# EAGLE design main (EAGLE 8.3.0)
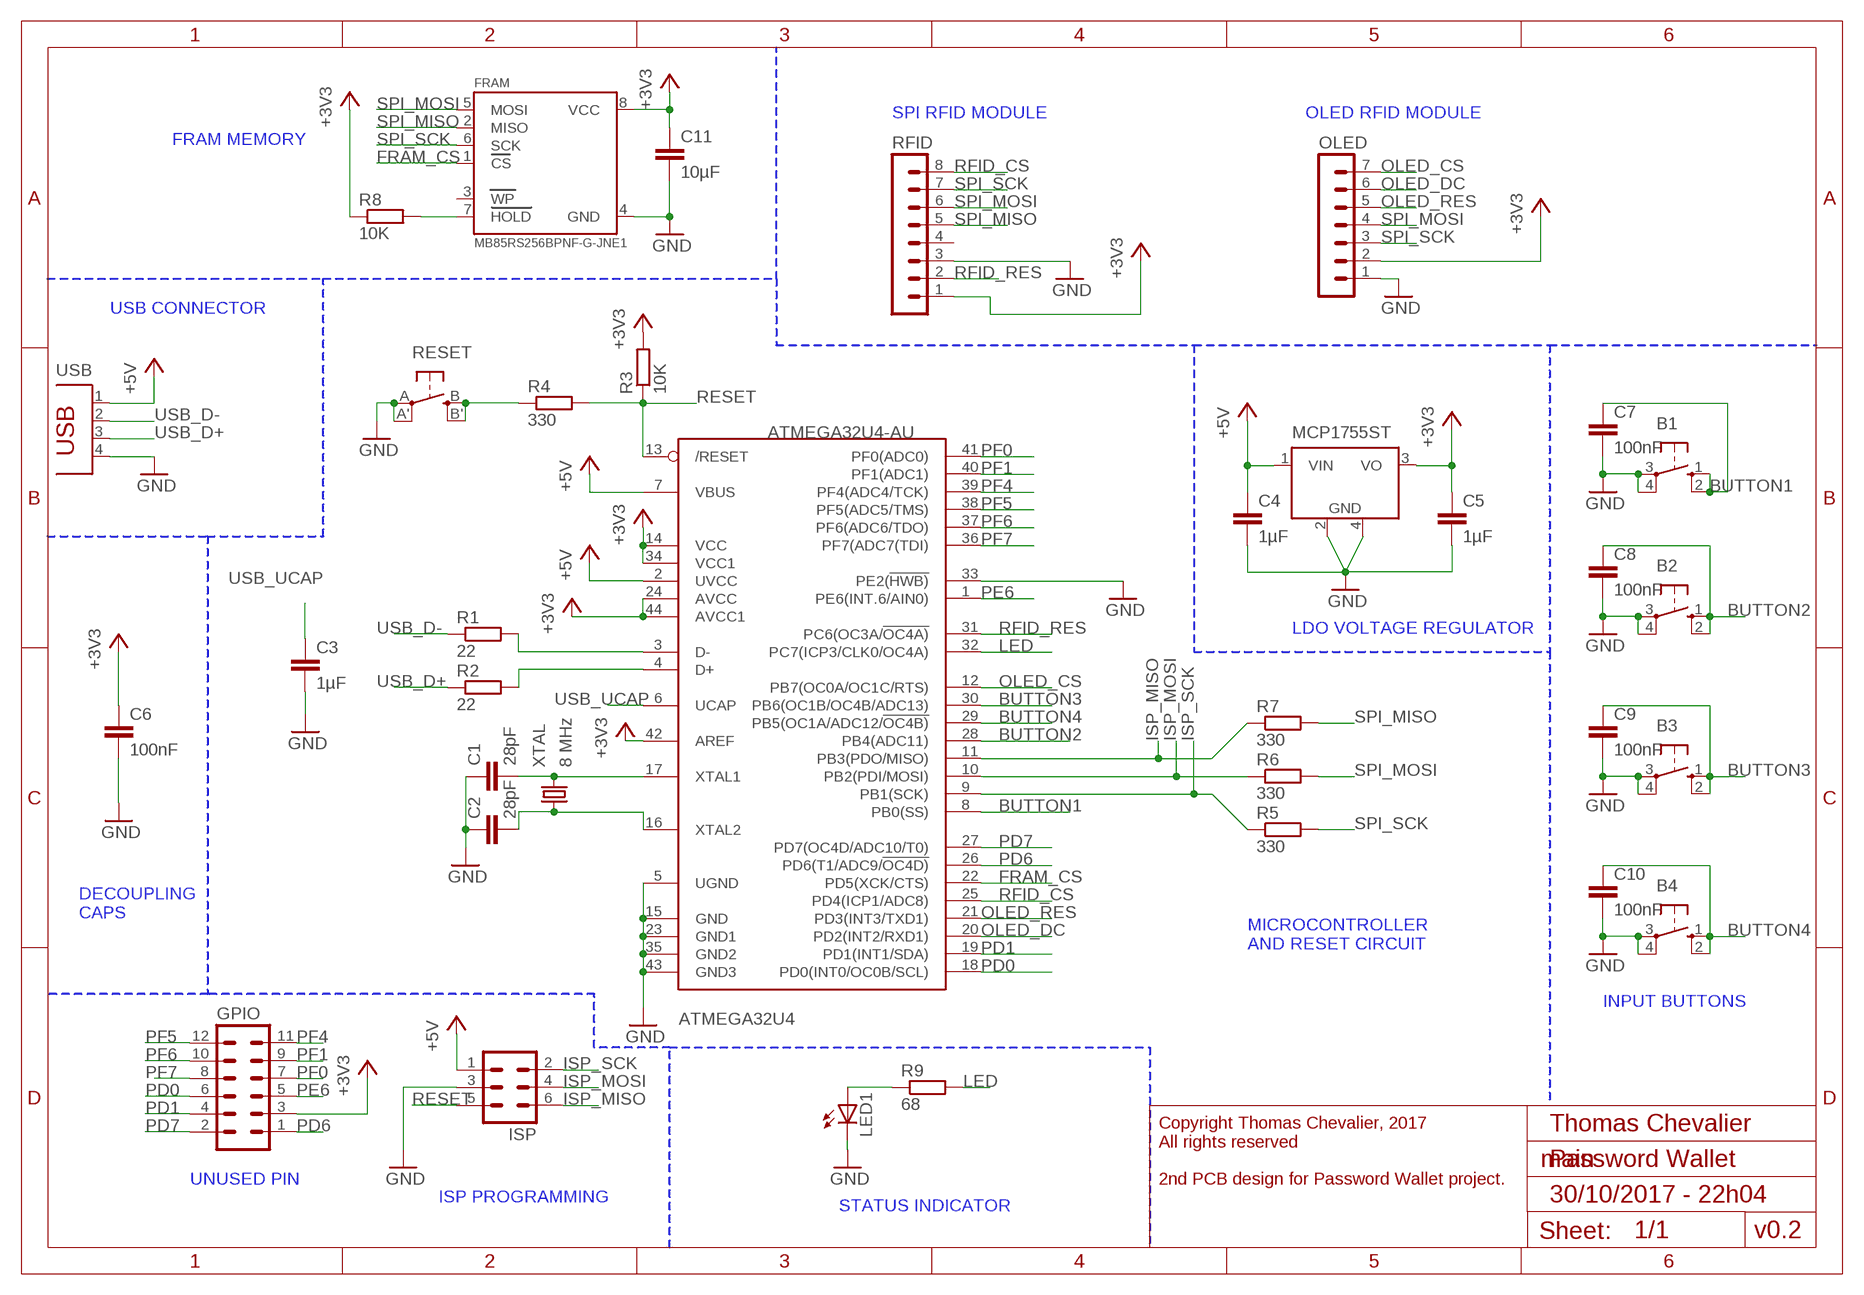
[diagram p0: schematic, sheet 1]

## Parts
ATMEGA32U4  ATMEGA32U4-AU  [TQFP44]
B1  10-XX  [B3F-10XX]
B2  10-XX  [B3F-10XX]
B3  10-XX  [B3F-10XX]
B4  10-XX  [B3F-10XX]
C1  28pF  C-EUC0805  [C0805]
C2  28pF  C-EUC0805  [C0805]
C3  1µF  C-EUC0805  [C0805]
C4  1µF  C-EUC0805  [C0805]
C5  1µF  C-EUC0805  [C0805]
C6  100nF  C-EUC0805  [C0805]
C7  100nF  C-EUC0805  [C0805]
C8  100nF  C-EUC0805  [C0805]
C9  100nF  C-EUC0805  [C0805]
C10  100nF  C-EUC0805  [C0805]
C11  10µF  C-EUC0805  [C0805]
FRAM  MB85RS256BPNF-G-JNE1  FRAM_SOIC8_SPI  [SOIC8_150MIL]
GPIO  MA06-2  [MA06-2]
ISP  MA03-2  [MA03-2]
LED1  LEDCHIP-LED0805  [CHIP-LED0805]
MCP1755ST  LM2936MP-3.0  [SOT223]
OLED  MA07-1  [MA07-1]
R1  22  R-EU_R0805  [R0805]
R2  22  R-EU_R0805  [R0805]
R3  10K  R-EU_R0805  [R0805]
R4  330  R-EU_R0805  [R0805]
R5  330  R-EU_R0805  [R0805]
R6  330  R-EU_R0805  [R0805]
R7  330  R-EU_R0805  [R0805]
R8  10K  R-EU_R0805  [R0805]
R9  68  R-EU_R0805  [R0805]
RESET  SPST_TACT-EVQQ2  [EVQ-Q2]
RFID  MA08-1  [MA08-1]
USB  PN87520  [PN87520]
XTAL  8 MHz  KX-9B  [5.0X3.2_2]

## Nets
+3V3: ATMEGA32U4.14(VCC) ATMEGA32U4.24(AVCC) ATMEGA32U4.34(VCC1) ATMEGA32U4.42(AREF) ATMEGA32U4.44(AVCC1) C5.1 C6.1 C11.1 FRAM.8(VCC) GPIO.3 MCP1755ST.3(VO) OLED.2 R3.2 R8.1 RFID.1
+5V: ATMEGA32U4.2(UVCC) ATMEGA32U4.7(VBUS) C4.1 ISP.1 MCP1755ST.1(VIN) USB.1
BUTTON1: ATMEGA32U4.8(PB0(SS)) B1.1(S) B1.2(S1) C7.1
BUTTON2: ATMEGA32U4.28(PB4(ADC11)) B2.1(S) B2.2(S1) C8.1
BUTTON3: ATMEGA32U4.30(PB6(OC1B/OC4B/ADC13)) B3.1(S) B3.2(S1) C9.1
BUTTON4: ATMEGA32U4.29(PB5(OC1A/ADC12/!OC4B)) B4.1(S) B4.2(S1) C10.1
FRAM_CS: ATMEGA32U4.22(PD5(XCK/CTS)) FRAM.1(CS)
GND: ATMEGA32U4.5(UGND) ATMEGA32U4.15(GND) ATMEGA32U4.23(GND1) ATMEGA32U4.33(PE2(!HWB)) ATMEGA32U4.35(GND2) ATMEGA32U4.43(GND3) B1.3(P) B1.4(P1) B2.3(P) B2.4(P1) B3.3(P) B3.4(P1) B4.3(P) B4.4(P1) C1.1 C2.1 C3.2 C4.2 C5.2 C6.2 C7.2 C8.2 C9.2 C10.2 C11.2 FRAM.4(GND) ISP.3 LED1.C MCP1755ST.2(GND) MCP1755ST.4(GND) OLED.1 RESET.A'(P1) RESET.A(P) RFID.3 USB.4
ISP_MISO: ATMEGA32U4.11(PB3(PDO/MISO)) ISP.6 R7.1
ISP_MOSI: ATMEGA32U4.10(PB2(PDI/MOSI)) ISP.4 R6.1
ISP_SCK: ATMEGA32U4.9(PB1(SCK)) ISP.2 R5.1
LED: ATMEGA32U4.32(PC7(ICP3/CLK0/OC4A)) R9.2
N$1: ATMEGA32U4.3(D-) R1.2
N$2: ATMEGA32U4.17(XTAL1) C1.2 XTAL.2
N$3: ATMEGA32U4.4(D+) R2.2
N$4: ATMEGA32U4.16(XTAL2) C2.2 XTAL.1
N$6: LED1.A R9.1
N$9: R4.1 RESET.B'(S1) RESET.B(S)
N$13: FRAM.7(HOLD) R8.2
OLED_CS: ATMEGA32U4.12(PB7(OC0A/OC1C/RTS)) OLED.7
OLED_DC: ATMEGA32U4.20(PD2(INT2/RXD1)) OLED.6
OLED_RES: ATMEGA32U4.21(PD3(INT3/TXD1)) OLED.5
PD0: ATMEGA32U4.18(PD0(INT0/OC0B/SCL)) GPIO.6
PD1: ATMEGA32U4.19(PD1(INT1/SDA)) GPIO.4
PD6: ATMEGA32U4.26(PD6(T1/ADC9/!OC4D)) GPIO.1
PD7: ATMEGA32U4.27(PD7(OC4D/ADC10/T0)) GPIO.2
PE6: ATMEGA32U4.1(PE6(INT.6/AIN0)) GPIO.5
PF0: ATMEGA32U4.41(PF0(ADC0)) GPIO.7
PF1: ATMEGA32U4.40(PF1(ADC1)) GPIO.9
PF4: ATMEGA32U4.39(PF4(ADC4/TCK)) GPIO.11
PF5: ATMEGA32U4.38(PF5(ADC5/TMS)) GPIO.12
PF6: ATMEGA32U4.37(PF6(ADC6/TDO)) GPIO.10
PF7: ATMEGA32U4.36(PF7(ADC7(TDI)) GPIO.8
RESET: ATMEGA32U4.13(/RESET) ISP.5 R3.1 R4.2
RFID_CS: ATMEGA32U4.25(PD4(ICP1/ADC8)) RFID.8
RFID_RES: ATMEGA32U4.31(PC6(OC3A/!OC4A)) RFID.2
SPI_MISO: FRAM.2(MISO) R7.2 RFID.5
SPI_MOSI: FRAM.5(MOSI) OLED.4 R6.2 RFID.6
SPI_SCK: FRAM.6(SCK) OLED.3 R5.2 RFID.7
USB_D+: R2.1 USB.3
USB_D-: R1.1 USB.2
USB_UCAP: ATMEGA32U4.6(UCAP) C3.1
Unconnected: FRAM.3(WP) RFID.4

## Notes on the sheet
- SPI RFID MODULE | OLED RFID MODULE
- FRAM MEMORY
- USB CONNECTOR
- LDO VOLTAGE REGULATOR
- DECOUPLING
  CAPS
- MICROCONTROLLER
  AND RESET CIRCUIT
- INPUT BUTTONS
- Thomas Chevalier
- Password Wallet
- UNUSED PIN
- Copyright Thomas Chevalier, 2017
  All rights reserved
  
  2nd PCB design for Password Wallet project.
- ISP PROGRAMMING | 30/10/2017 - 22h04
- STATUS INDICATOR
- v0.2

## Library data of the parts
ATMEGA32U4 = adafruit:ATMEGA32U4: http://www.ladyada.net/library/eagle
B1-B4 = switch-omron:10-XX: OMRON SWITCH; MPN: B3F-1000; OC_FARNELL: 176432; OC_NEWARK: 36M3542
C1-C11 = resistor:C-EU: CAPACITOR, European symbol
FRAM = microbuilder:FRAM_SOIC8_SPI: SPI FRAM - SOIC8 Package 64KBit (8Kx8) - MB85RS64VPNF-G-JNERE1 - SOIC-8 150 Mil, 3-5.5V, -40°C-85°C, 20MHz
GPIO = con-lstb:MA06-2: PIN HEADER; OC_FARNELL: unknown; OC_NEWARK: unknown
ISP = con-lstb:MA03-2: PIN HEADER; OC_FARNELL: unknown; OC_NEWARK: unknown
LED1 = adafruit:LED: LED OSRAM: - CHIPLED LG R971, LG N971, LY N971, LG Q971, LY Q971, LO R971, LY R971 LH N974, LH R974 LS Q976, LO Q976, LY Q976 LO Q996 - Hyper CHIPLED LW Q18S LB Q993, LB Q99A, LB R99A - SideLED LS A670, LO A670, LY A670, LG A670, LP A670 LB A673, LV A673, LT A673, LW A673 LH A674 LY A675 LS A676, LA A676, LO A676, LY A676, LW A676 LS A679, LY A679, LG A679 - Hyper Micro SIDELED® LS Y876, LA Y876, LO Y876, LY Y876 LT Y87S - SmartLED LW L88C, LW L88S LB L89C, LB L89S, LG L890 LS L89K, LO L89K, LY L89K LS L896, LA L896, LO L896, LY L896 - TOPLED LS T670, LO T670, LY T670, LG T670, LP T670 LSG T670, LSP T670, LSY T670, LOP T670, LYG T670 LG T671, LOG T671, LSG T671 LB T673, LV T673, LT T673, LW T673 LH T674 LS T676, LA T676, LO T676, LY T676, LB T676, LH T676, LSB T676, LW T676 LB T67C, LV T67C, LT T67C, LS T67K, LO T67K, LY T67K, LW E67C LS E67B, LA E67B, LO E67B, LY E67B, LB E67C, LV E67C, LT E67C LW T67C LS T679, LY T679, LG T679 LS T770, LO T770, LY T770, LG T770, LP T770 LB T773, LV T773, LT T773, LW T773 LH T774 LS E675, LA E675, LY E675, LS T675 LS T776, LA T776, LO T776, LY T776, LB T776 LHGB T686 LT T68C, LB T68C - Hyper Mini TOPLED® LB M676 - Mini TOPLED Santana® LG M470 LS M47K, LO M47K, LY M47K Source: http://www.osram.convergy.de/
MCP1755ST = national-semiconductor:LM2936MP?*: Ultra-Low Quiescent Current LDO Voltage Regulator Source: Data sheet <http://www.national.com/ds/LM/LM2936.pdf>; MF: NATIONAL SEMICONDUCTOR; MPN: LM2936MP-3.0/NOPB; OC_FARNELL: 1496125; OC_NEWARK: 41K4522
OLED = con-lstb:MA07-1: PIN HEADER; OC_FARNELL: unknown; OC_NEWARK: unknown
R1-R9 = resistor:R-EU_: RESISTOR, European symbol
RESET = adafruit:SPST_TACT: SMT 6mm switch, EVQQ2 series http://www.ladyada.net/library/eagle
RFID = con-lstb:MA08-1: PIN HEADER; OC_FARNELL: unknown; OC_NEWARK: unknown
USB = con-berg:PN87520: BERG USB connector; OC_FARNELL: unknown; OC_NEWARK: unknown
XTAL = crystal-geyer_V1_0:KX: Quartz Crystals (MHz) SMD: KX - Serie Model Size l/w/h [mm] Frequency Range Frequency Stability Temp. Range [°C] Load Capacitance AECQ 200 availabel Datasheet KX-4 KX-5 KX-6 KX-7 KX-9A KX-9B KX-12A KX-12B KX-13 KX-20 KX-K KX-KS 1.6/1.2/0.3 2.0/1.6/0.45 2.5/2.0/0.55 3.2/2.5/0.8 5.0/3.2/1.0 5.0/3.2/1.1 6.0/3.5/1.1 6.0/3.5/1.0 7.0/5.0 /1.3 11.6/5.5/1.6 12.3/4.5/4.2 12.3/4.5/3.2 24.0 ~ 80.0 MHz 16.0 ~ 80.0 MHz 12.0 ~ 80.0 MHz 8.0 ~ 60.0 MHz 7,68 ~ 300,0 MHz 8,0 ~ 50,0 MHz 8,0 ~ 150,0 MHz 8,0 ~ 50,0 MHz 6,0 ~ 160,0 MHz 3,579 ~ 25,0 MHz 3,579 ~ 70,0 MHz 3,579 ~ 70,0 MHz ±10 … ±50ppm ±10 … ±50ppm ±10 … ±50ppm ±10 … ±50ppm ±10 … ±50ppm ±10 … ±50ppm ±10 … ±50ppm ±10 … ±50ppm ±10 … ±50ppm ±50ppm ±10 … ±50ppm ±10 … ±50ppm (*) -40°C …+85°C (*) -40°C …+125°C (*) -40°C …+125°C (*) -40°C …+125°C (*) -40°C …+105°C (*) -40°C …+105°C (*) -40°C …+125°C (*) -40°C …+105°C (*) -40°C …+105°C (*) -40°C …+105°C (*) -40°C …+85°C (*) -40°C …+85°C 8, 8…16 8, 8…16 10, 8…16 12, 7…20 16, 10…20 16, 10…20 16, 10…20 16, 12…20 16, 12…20 16, 12…20 16, 12…30 16, 12…30 - yes yes yes - - - - - - - - KX-4.pdf <http://www.geyer-electronic.de/uploads/tx_userartikelfrequenz/GEYER-KX-4.pdf> KX-5.pdf <http://www.geyer-electronic.de/uploads/tx_userartikelfrequenz/GEYER-KX-5.pdf> KX-6.pdf <http://www.geyer-electronic.de/uploads/tx_userartikelfrequenz/GEYER-KX-6.pdf> KX-7.pdf <http://www.geyer-electronic.de/uploads/tx_userartikelfrequenz/GEYER-KX-7.pdf> KX-9A.pdf <http://www.geyer-electronic.de/uploads/tx_userartikelfrequenz/GEYER-KX-9A.pdf> KX-9B.pdf <http://www.geyer-electronic.de/uploads/tx_userartikelfrequenz/GEYER-KX-9B.pdf> KX-12A.pdf <http://www.geyer-electronic.de/uploads/tx_userartikelfrequenz/GEYER-KX-12A.pdf> KX-12B.pdf <http://www.geyer-electronic.de/uploads/tx_userartikelfrequenz/GEYER-KX-12B.pdf> KX-13.pdf <http://www.geyer-electronic.de/uploads/tx_userartikelfrequenz/GEYER-KX-13.pdf> KX-20.pdf <http://www.geyer-electronic.de/uploads/tx_userartikelfrequenz/GEYER-KX-20.pdf> KX-K.pdf <http://www.geyer-electronic.de/uploads/tx_userartikelfrequenz/GEYER-KX-K.pdf> KX-KS.pdf <http://www.geyer-electronic.de/uploads/tx_userartikelfrequenz/GEYER-KX-KS.pdf> <http://www.geyer-electronic.de/fileadmin/template/img/logo-geyer-electronic.png> Details see: http://www.geyer-electronic.de/Frequenz-Produkte.9.0.html Created 2016-06-07, Hans Locher 2016 (C) Geyer Quartz Technology KX4,KX5,KX6,KX7,KX9A,KX9B,KX12A,KX12B,KX13,KX20,KXK,KXKS;1612;2016;2520;3225;5032;6035;7050;11655;12345;1,6x1,2;2,0x1,6;2,5x2,0;3,2x2,5;5,0x3,2;6,0x3,5;7,0x5,0;11,6x5,5;12,3x4,5;12,3x4,5;1.6x1.2;2.0x1.6;2.5x2.0;3.2x2.5;5.0x3.2;6.0x3.5;7.0x5.0;11.6x5.5;12.3x4.5;12.3x4.5;

## Board
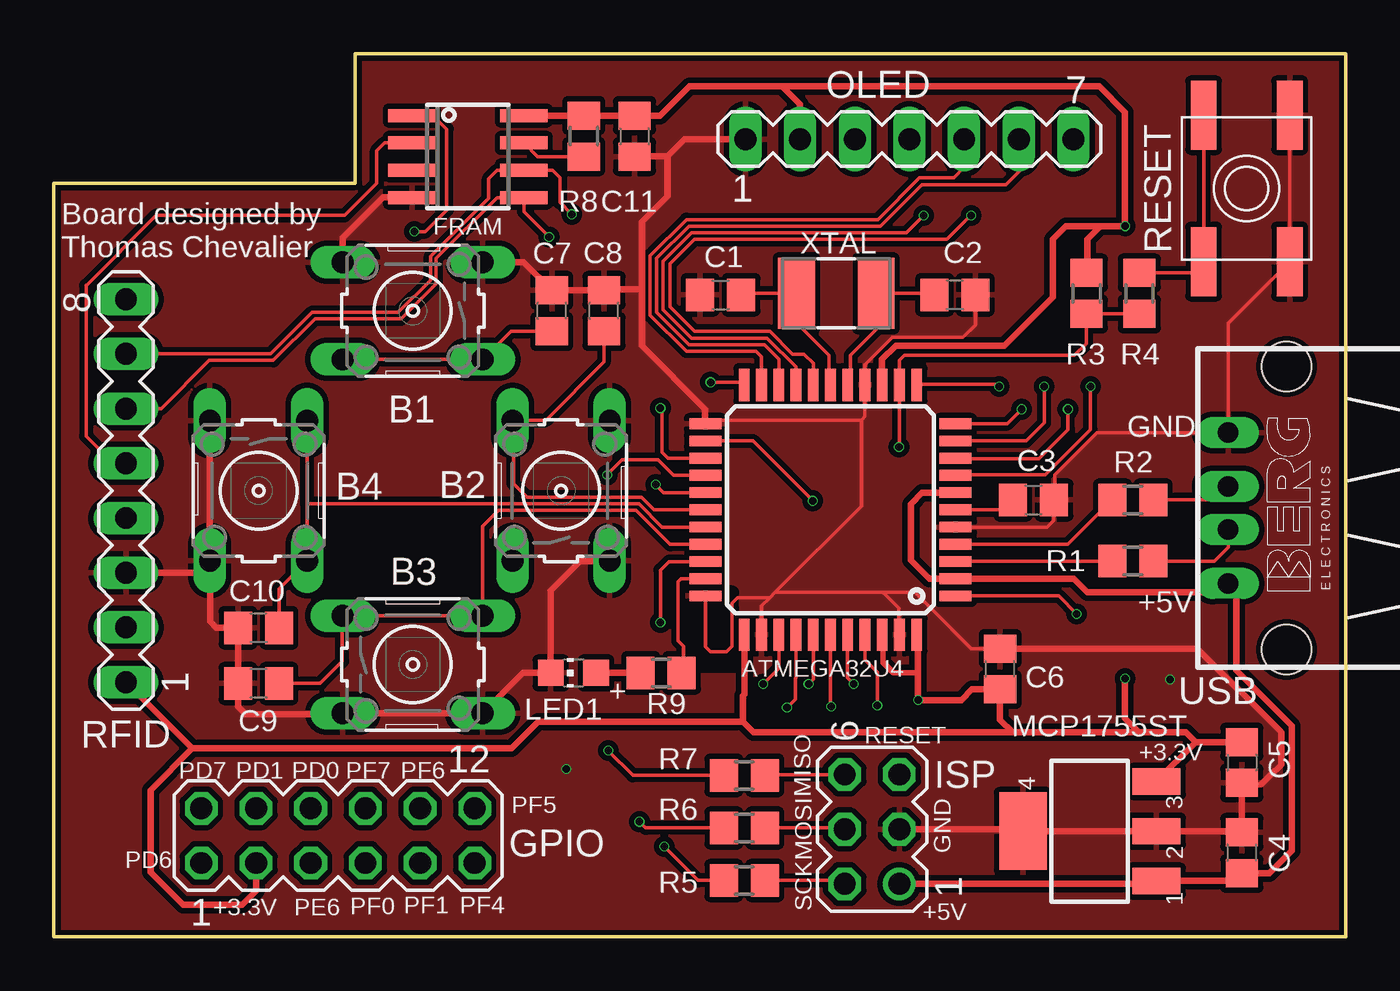
[diagram p1: board, top side]
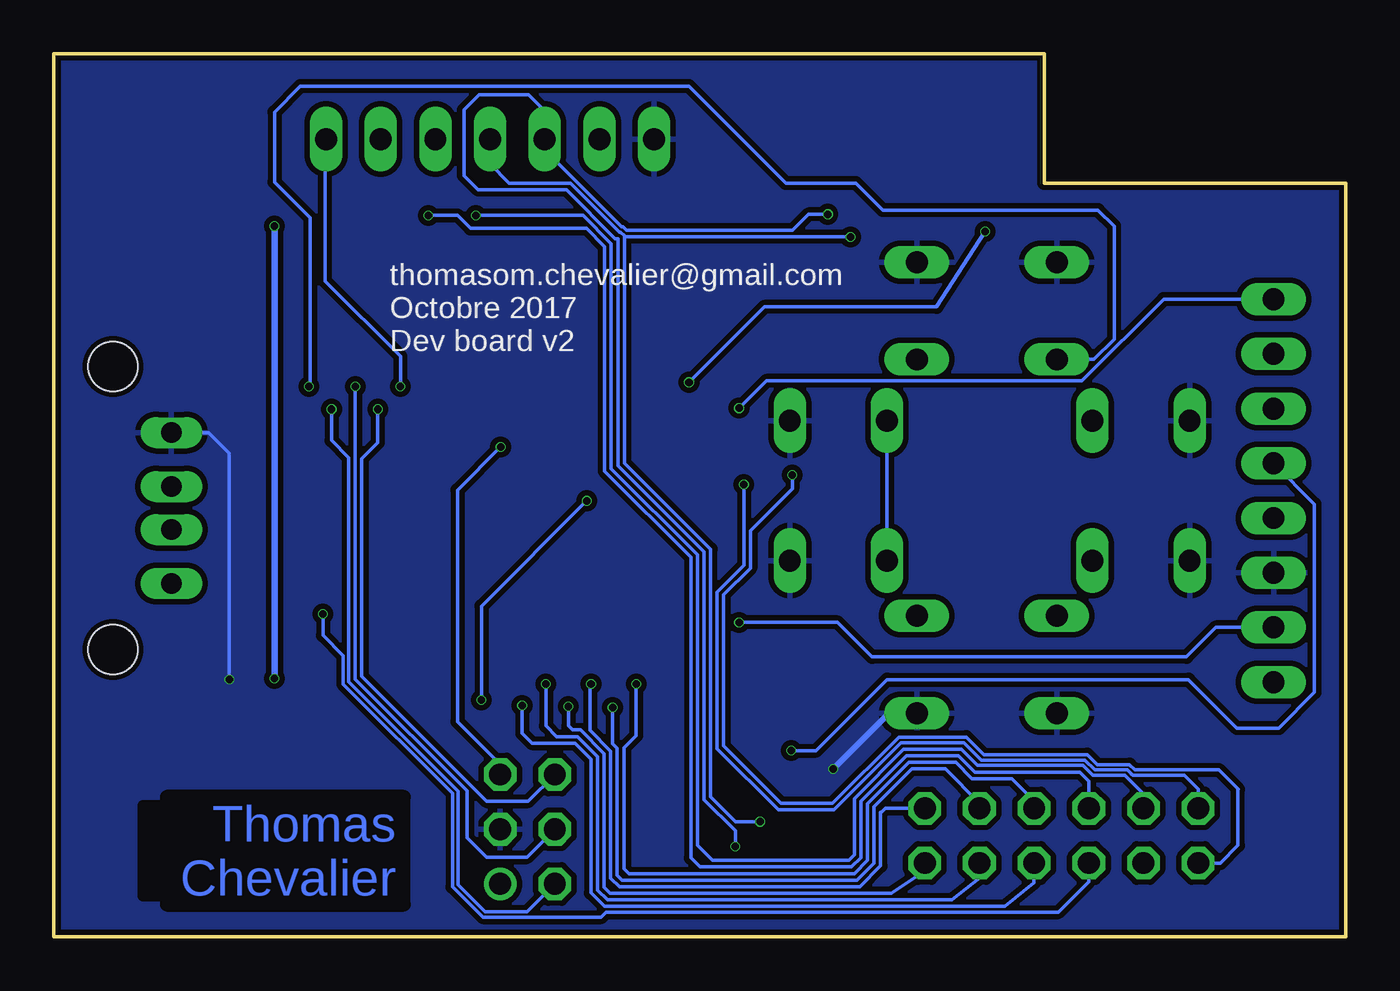
[diagram p2: board, bottom side, seen from below]

Size 60 x 41 mm. Coordinates in mm from the lower left corner, seen from the top.
Outline: 0,0 60,0 60,41 14,41 14,35 0,35 0,0
Copper layers (1*16): Top 0.035mm / dielectric 1.5mm / Bottom 0.035mm
Design rules "aisler_go_2layer": minimum track width 0.1mm, minimum drill 0.2mm, track to track 0.1mm, track to pad 0.1mm, pad to pad 0.1mm, via to via 0.1mm, smd to smd 0.1mm, copper to edge 0.2mm, drill to drill 0.21mm, minimum pad ring 0.25mm, minimum via ring 0.05mm, stop-mask expansion 0.01mm, vias tented up to drill 0mil, thermal gap 10mil
tRestrict: area 29.8,13.2 to 31.5,15.2; area 31,15.2 to 31.5,16; area 29.9,12.6 to 31.8,13.2
bRestrict: area 43.8,1.5 to 54.8,6.5

### Footprints (pad centres in the part's own frame; a part is rotated, then mirrored left to right if it is on the bottom)
TQFP44 = smd 1.5 x 0.5: 1 -5.8,4; 2 -5.8,3.2; 3 -5.8,2.4; 4 -5.8,1.6; 5 -5.8,0.8; 6 -5.8,0; 7 -5.8,-0.8; 8 -5.8,-1.6; 9 -5.8,-2.4; 10 -5.8,-3.2; 11 -5.8,-4; 23 5.8,-4; 24 5.8,-3.2; 25 5.8,-2.4; 26 5.8,-1.6; 27 5.8,-0.8; 28 5.8,0; 29 5.8,0.8; 30 5.8,1.6; 31 5.8,2.4; 32 5.8,3.2; 33 5.8,4 | smd 0.5 x 1.5: 12 -4,-5.8; 13 -3.2,-5.8; 14 -2.4,-5.8; 15 -1.6,-5.8; 16 -0.8,-5.8; 17 0,-5.8; 18 0.8,-5.8; 19 1.6,-5.8; 20 2.4,-5.8; 21 3.2,-5.8; 22 4,-5.8; 34 4,5.8; 35 3.2,5.8; 36 2.4,5.8; 37 1.6,5.8; 38 0.8,5.8; 39 0,5.8; 40 -0.8,5.8; 41 -1.6,5.8; 42 -2.4,5.8; 43 -3.2,5.8; 44 -4,5.8
B3F-10XX = drill 1.016 long: 1 -3.251,2.261; 2 3.251,2.261; 3 -3.251,-2.261; 4 3.251,-2.261
C0805 = smd 1.3 x 1.5: 1 -0.95,0; 2 0.95,0
SOIC8_150MIL = smd 0.6 x 2.2: 1 -1.905,-2.6; 2 -0.635,-2.6; 3 0.635,-2.6; 4 1.905,-2.6; 5 1.905,2.6; 6 0.635,2.6; 7 -0.635,2.6; 8 -1.905,2.6
MA06-2 = drill 1.016 octagon: 1 -6.35,-1.27; 2 -6.35,1.27; 3 -3.81,-1.27; 4 -3.81,1.27; 5 -1.27,-1.27; 6 -1.27,1.27; 7 1.27,-1.27; 8 1.27,1.27; 9 3.81,-1.27; 10 3.81,1.27; 11 6.35,-1.27; 12 6.35,1.27
MA03-2 = drill 1.016: 1 -2.54,-1.27 | drill 1.016 octagon: 2 -2.54,1.27; 3 0,-1.27; 4 0,1.27; 5 2.54,-1.27; 6 2.54,1.27
CHIP-LED0805 = smd 1.2 x 1.2: A 0,-1.05; C 0,1.05
SOT223 = smd 1.219 x 2.235: 1 -2.311,-3.099; 2 0,-3.099; 3 2.311,-3.099 | smd 3.6 x 2.2: 4 0,3.099
MA07-1 = drill 1.016 long: 1 -7.62,0; 2 -5.08,0; 3 -2.54,0; 4 0,0; 5 2.54,0; 6 5.08,0; 7 7.62,0
R0805 = smd 1.3 x 1.5: 1 -0.95,0; 2 0.95,0
EVQ-Q2 = smd 3.2 x 1.2: A -3.4,-2; A' 3.4,-2; B -3.4,2; B' 3.4,2
MA08-1 = drill 1.016 long: 1 -8.89,0; 2 -6.35,0; 3 -3.81,0; 4 -1.27,0; 5 1.27,0; 6 3.81,0; 7 6.35,0; 8 8.89,0
PN87520 = drill 0.95 long: 1 -3.5,2.71; 2 -1,2.71; 3 1,2.71; 4 3.5,2.71 | hole 2.3: -6.57,0; 6.57,0
5.0X3.2_2 = smd 1.7 x 3.3: 1 -1.85,0; 2 1.85,0

### Placement (x,y rotation side)
ATMEGA32U4  36.07,19.83 180 top
B1  16.67,29.07 180 top
B2  23.56,20.72 90 top
B3  16.67,12.65 0 top
B4  9.51,20.72 270 top
C1  30.97,29.81 0 top
C2  41.85,29.81 180 top
C3  45.5,20.29 0 top
C4  55.18,3.9 90 top
C5  55.18,8.1 270 top
C6  43.95,12.44 90 top
C7  23.13,29.07 90 top
C8  25.55,29.07 90 top
C9  9.51,11.77 180 top
C10  9.51,14.35 180 top
C11  26.97,37.18 270 top
FRAM  19.23,36.23 270 top
GPIO  13.2,4.7 0 top
ISP  38,5 90 top
LED1  24.13,12.26 90 top
MCP1755ST  48.11,4.91 90 top
OLED  39.74,37.04 0 top
R1  50.12,17.45 180 top
R2  50.12,20.29 180 top
R3  47.96,29.88 90 top
R4  50.42,29.88 270 top
R5  32.07,2.62 180 top
R6  32.07,5.06 180 top
R7  32.07,7.5 180 top
R8  24.61,37.18 270 top
R9  28.21,12.26 0 top
RESET  55.4,34.75 90 top
RFID  3.35,20.72 90 top
USB  57.25,19.91 90 top
XTAL  36.34,29.88 180 top

### Tracks (layer width: path | path; a pad name or v marks a point on that pad's centre or on a via)
+3V3  (via drill 0.35)
  Top 0.152: ATMEGA32U4.24 32.47,23.03 v35.25,20.25
  Top 0.254: ATMEGA32U4.42 38.5,14 38.5,12.75 38.99,12.26 40.14,12.26
  Top 0.305: 33.81,39.5 29.52,39.5 28.14,38.13 C11.1 R8.1 FRAM.8 | ATMEGA32U4.34 32.07,11.26 32,11.19 32,10 | ATMEGA32U4.14 38.47,26.82 39.1,27.45 44.15,27.45 46.4,29.7 46.4,32.4 47,33 48.6,33 | 32,10 32.5,9.5 44.54,9.5 | 32,10 22.5,10 21.25,8.75 6.43,8.75 | 6.43,8.75 RFID.1 | GPIO.3 9.39,2.14 8.75,1.5 6,1.5 4.5,3 4.5,6.82 6.43,8.75 | OLED.2 34.66,38.65 33.81,39.5 | 33.81,39.5 48.55,39.5 49.75,38.3 v49.75,33 48.6,33 | 48.6,33 48,32.4 48,30.87 R3.2 | ATMEGA32U4.44 40.14,13.96 40.14,12.26 v40.14,11 42.15,11 42.65,11.5 43.79,11.5 43.95,11.34 | MCP1755ST.3 53.04,9.05 | 53.04,9.05 C5.1 | 53.04,9.05 52.59,9.5 50.4,9.5 | 50.4,9.5 44.54,9.5 | 43.95,11.34 C6.1 | 43.95,11.34 43.95,10.09 44.54,9.5 | v49.75,12 49.75,10.15 50.4,9.5
  Bottom 0.152: v35.25,20.25 40.14,15.36 v40.14,11
  Bottom 0.305: v49.75,33 v49.75,12
+5V
  Top 0.305: ISP.1 51.07,2.46 MCP1755ST.1 55.35,2.6 C4.1 56.45,2.95 57.5,4 57.5,9.81 54.93,12.38 54.93,16.02 USB.1 54.13,16 48,16 47.37,16.63 ATMEGA32U4.2 40.67,16.63 39.8,17.5 39.8,20.1 40.33,20.63 ATMEGA32U4.7
BUTTON1  (via drill 0.35)
  Top 0.152: ATMEGA32U4.8 41.89,21.45 46.05,21.45 48.15,23.55 v48.15,25.55 | B1.2 B1.1 21.23,28.12 C7.1
  Bottom 0.152: B1.2 11.69,26.81 10.75,27.75 10.75,33 11.5,33.75 21.5,33.75 22.75,35 26,35 30.5,39.5 48.55,39.5 49.75,38.3 49.75,35.05 48.1,33.4 48.1,25.6 v48.15,25.55
BUTTON2
  Top 0.152: C8.1 25.55,26.7 22.85,24 21.35,24 | 21.35,24 21.33,24 B2.2 | ATMEGA32U4.28 27.88,19.83 27.3,20.41 21.99,20.41 21.35,21.05 21.35,24
  Bottom 0.152: B2.2 B2.1
BUTTON3
  Top 0.152: C9.1 12.37,11.77 13.4,12.8 13.4,14.89 B3.1 B3.2 19.92,19.07 20.65,19.8 27.05,19.8 28.62,18.23 ATMEGA32U4.30
BUTTON4
  Top 0.152: 11.77,20.03 B4.2 10.46,16.16 C10.1 | 11.77,20.03 B4.1 | ATMEGA32U4.29 28.25,19.03 27.18,20.1 11.84,20.1 11.77,20.03
FRAM_CS  (via drill 0.35)
  Top 0.152: v30.5,25.75 31.95,25.75 ATMEGA32U4.22 | v16.75,32.75 17.25,32.75 18.25,33.75 18.25,37.5 17.61,38.13 FRAM.1
  Bottom 0.152: v16.75,32.75 19,29.25 27,29.25 v30.5,25.75
GND  (via drill 0.35)
  Top 0.152: ATMEGA32U4.35 32.87,15.37 33.25,15.75 | 33.5,16 38.5,16 | 38.5,16 39.25,15.25 39.25,14.05 ATMEGA32U4.43 | ATMEGA32U4.23 30.28,23.83 30.45,24 37.5,24 | 37.75,25.55 ATMEGA32U4.15 | 38.5,16 40,16 42.61,13.39 C6.2 | ATMEGA32U4.15 37.67,24.17 37.5,24 | 37.5,24 37.5,20 33.5,16 | ATMEGA32U4.15 37.67,26.56 38.94,27.83 42.23,27.83 42.8,28.4 C2.1 | ATMEGA32U4.5 46.13,19.03 46.45,19.35 C3.2 46.49,20.33 46.49,21.46 48.44,23.41 USB.4 54.54,28.49 RESET.A RESET.A' | ATMEGA32U4.33 30.27,13.48 30.5,13.25 31.25,13.25 31.5,13.5 31.5,15.5 31.75,15.75 33.25,15.75 | 33.25,15.75 33.5,16
  Top 0.254: 56.5,7.5 56.06,7.06 55.18,7.06
  Top 0.305: ISP.3 44.92,5 MCP1755ST.4 MCP1755ST.2 55.12,4.91 C4.2 55.18,7.06 C5.2 | 56.5,7.5 57,8 57,9.5 53.11,13.39 C6.2 | RFID.3 6.69,16.91 B4.4 7.25,17.64 | 7.25,17.64 B4.3 | C11.2 26.49,36.25 28.5,36.25 | 28.5,36.25 29.29,37.04 OLED.1 | 27.31,30.06 27.31,27.44 30.25,24.5 30.25,23.86 30.28,23.83 | 27.31,30.06 27.31,33.21 28.5,34.4 28.5,36.25 | 27.31,30.06 25.59,30.06 C8.2 C7.2 21.82,31.33 B1.3 | FRAM.4 16.61,34.35 15.3,34.35 13.42,32.47 B1.4 | 7.25,17.64 7.25,14.65 7.55,14.35 C10.2 C9.2 8.56,10.69 8.9,10.35 13.38,10.35 B3.3 B3.4 21.79,12.26 LED1.C 23.08,16.08 24.45,17.45 25.8,17.45 B2.3
  Bottom 0.152: USB.4 52.8,23.4 51.85,22.45 v51.85,11.95
  Bottom 0.305: B3.4 21.21,10.39 v23.8,7.8
  pour Top (isolate 0.254): 0,35 0,0 60,0 60,41 14,41 14,35
  pour Bottom (isolate 0.254): 0,35 0,0 60,0 60,41 14,41 14,35
ISP_MISO  (via drill 0.35)
  Top 0.152: 41.87,23.87 ATMEGA32U4.11 44.28,23.83 v44.95,24.5 | ISP.6 33.06,7.54 R7.1
  Bottom 0.152: v44.95,24.5 44.95,22.95 45.7,22.2 45.7,12.09 39.9,6.3 37.97,6.3 ISP.6
ISP_MOSI  (via drill 0.35)
  Top 0.152: ATMEGA32U4.10 45.16,23.03 46,23.87 v46,25.55 | R6.1 36.67,5.06 ISP.4
  Bottom 0.152: ISP.4 38.03,3.7 39.9,3.7 40.82,4.62 40.82,6.78 46,11.97 v46,25.55
ISP_SCK  (via drill 0.35)
  Top 0.152: ATMEGA32U4.9 41.9,22.2 45.75,22.2 47.1,23.55 v47.1,24.5 | R5.1 36.57,2.62 ISP.2
  Bottom 0.152: v47.1,24.5 47.1,23.05 46.3,22.26 46.3,12.09 | 46.3,12.09 | 46.3,12.09 46.3,11.84 41.23,6.77 41.23,2.43 39.97,1.17 38.02,1.17 ISP.2
LED
  Top 0.152: ATMEGA32U4.32 29.13,16.63 29,16.5 29,13.75 29.25,13.5 29.25,12.35 R9.2
N$1
  Top 0.152: R1.2 41.89,17.45 ATMEGA32U4.3
N$2
  Top 0.152: ATMEGA32U4.17 36,25.7 36,27 34.49,28.51 XTAL.2 31.99,29.88 C1.2
N$3
  Top 0.152: ATMEGA32U4.4 47.1,18.23 R2.2
N$4
  Top 0.152: ATMEGA32U4.16 37,25.76 37,27 38.19,28.19 XTAL.1 40.83,29.88 C2.2
N$6
  Top 0.305: R9.1 LED1.A
N$9
  Top 0.152: 50.81,31.22 R4.1 52.88,30.83 RESET.B RESET.B'
N$13
  Top 0.152: FRAM.7 22.46,36.23 R8.2
OLED_CS  (via drill 0.35)
  Top 0.152: ATMEGA32U4.12 40.09,25.65 43.8,25.65 v43.9,25.55
  Bottom 0.152: v43.9,25.55 43.9,26.95 47.4,30.45 47.4,37 OLED.7
OLED_DC
  Top 0.152: 29.5,33 28,31.5 28,29 29.5,27.5 33,27.5 33.67,26.83 ATMEGA32U4.20 33.5,25.8 | 29.5,33 | 29.5,33 38.39,33 40.32,34.93 44.23,34.93 44.85,35.55 44.85,37.01 OLED.6
OLED_RES
  Top 0.152: ATMEGA32U4.21 32.87,26.93 32.6,27.2 29.37,27.2 27.7,28.87 27.7,31.63 29.37,33.3 38.26,33.3 40.21,35.25 41.8,35.25 42.3,35.75 42.3,37.02 OLED.5
PD0  (via drill 0.35)
  Top 0.152: ATMEGA32U4.18 35.27,26.63 34.85,27.05 34.31,27.05 33.25,28.11 29.75,28.11 28.61,29.25 28.61,31.25 29.75,32.39 41.49,32.39 v42.6,33.5
  Bottom 0.152: v42.6,33.5 41.26,33.5 40.65,32.89 35.26,32.89 34.41,32.05 34.41,21.62 30.41,17.62 30.41,3.66 30,3.25 22.95,3.25 22.51,3.68 22.51,6.3 20.4,8.41 17.98,8.41 17.22,7.66 15.37,7.66 15.37,7.65 12.35,7.65 11.93,7.23 GPIO.6
PD1  (via drill 0.35)
  Top 0.152: ATMEGA32U4.19 34.47,26.46 33.13,27.8 29.63,27.8 28.3,29.13 28.3,31.37 29.63,32.7 39.59,32.7 v40.4,33.5
  Bottom 0.152: v40.4,33.5 35.43,33.5 34.11,32.18 34.11,21.75 30.11,17.75 30.11,4.26 29.4,3.55 23.07,3.55 22.82,3.8 22.82,6.42 20.53,8.71 17.85,8.71 17.1,7.96 12.21,7.96 11.75,7.5 10.25,7.5 9.39,6.64 GPIO.4
PD6  (via drill 0.35)
  Top 0.152: ATMEGA32U4.26 28.77,21.43 28.05,22.15 26.4,22.15 v25.7,21.45
  Bottom 0.152: v25.7,21.45 25.7,20.8 27.64,18.85 27.64,17.12 28.89,15.88 28.89,8.87 26.82,6.8 | 26.82,6.8 | 26.82,6.8 26.22,6.2 23.83,6.2 20.76,9.27 17.62,9.27 16.81,8.46 12,8.46 11.54,8.01 10.04,8.01 9.79,7.75 5.89,7.75 5,6.86 5,6.85 5,4.25 5.82,3.43 GPIO.1
PD7  (via drill 0.35)
  Top 0.152: ATMEGA32U4.27 28.32,20.63 v27.95,21
  Bottom 0.152: v27.95,21 27.95,17.25 29.2,16.01 29.2,8.74 26.35,5.9 23.77,5.9 20.66,9.02 17.73,9.02 16.92,8.21 12.11,8.21 11.64,7.75 10.14,7.75 9.89,7.5 | 9.95,7.55 9.89,7.5 | GPIO.2 6.85,6.85 7.5,7.5 9.89,7.5
PE6  (via drill 0.35)
  Top 0.152: ATMEGA32U4.1 46.67,15.83 v47.5,15
  Bottom 0.152: v47.5,15 47.5,14 46.56,13.06 46.56,12.2 | 46.56,12.2 | 46.56,12.2 46.56,11.74 41.48,6.66 41.48,2.33 40.07,0.92 34.58,0.92 34.35,1.15 13.35,1.15 11.93,2.57 GPIO.5
PF0  (via drill 0.35)
  Top 0.152: ATMEGA32U4.41 37.67,12.88 38.25,12.3 v38.25,10.75
  Bottom 0.152: v38.25,10.75 38.25,9.45 37.8,9 35.8,9 35.05,8.25 35.05,2.05 34.42,1.42 15.82,1.42 14.47,2.52 GPIO.7
PF1  (via drill 0.35)
  Top 0.152: ATMEGA32U4.40 36.87,12.03 v37.15,11.75
  Bottom 0.152: v37.15,11.75 37.15,9.8 36.66,9.3 35.67,9.3 34.74,8.38 34.74,2.18 34.29,1.72 18.28,1.72 17,2.75 GPIO.9
PF4  (via drill 0.35)
  Top 0.152: ATMEGA32U4.39 36.07,10.73 v36.1,10.7
  Bottom 0.152: v36.1,10.7 36.1,9.8 35.91,9.61 35.55,9.61 34.44,8.5 34.44,2.3 34.17,2.03 21.1,2.03 19.55,3.08 GPIO.11
PF5  (via drill 0.35)
  Top 0.152: ATMEGA32U4.38 35.27,11.97 v35.05,11.75
  Bottom 0.152: v35.05,11.75 35.1,11.7 35.1,9.59 34.14,8.63 34.14,2.74 33.73,2.33 22.57,2.33 21.6,3.3 21.6,5.75 | 21.6,5.75 21.6,5.8 | 21.6,5.75 21.38,5.97 GPIO.12
PF6  (via drill 0.35)
  Top 0.152: ATMEGA32U4.37 34.47,12.03 34.44,12 34.44,11.04 v34.05,10.65
  Bottom 0.152: v34.05,10.65 34.05,8.97 33.83,8.76 33.83,2.86 33.61,2.64 22.69,2.64 21.91,3.43 21.91,6.05 20.15,7.8 18.6,7.8 17.01,6.21 GPIO.10
PF7  (via drill 0.35)
  Top 0.152: ATMEGA32U4.36 33.67,12.47 v32.95,11.75
  Bottom 0.152: v32.95,11.75 32.95,9.35 33.53,8.77 33.53,3.18 33.29,2.94 22.82,2.94 22.21,3.55 22.21,6.17 20.28,8.1 18.41,8.1 | 18.41,8.1 18.4,8.1 | 18.41,8.1 18.11,8.1 17.35,7.35 15.5,7.35 14.47,6.32 GPIO.8
RESET  (via drill 0.35)
  Top 0.152: v39.25,22.75 39.27,22.77 ATMEGA32U4.13 39.27,26.77 39.5,27 47.4,27 47.95,27.55 47.95,28.87 48.01,28.93 | 48.01,28.93 R3.1 | 48.01,28.93 R4.2
  Bottom 0.152: 39.25,7.56 ISP.5 39.27,8.02 41.25,10 41.25,20.75 v39.25,22.75
RFID_CS  (via drill 0.35)
  Top 0.152: ATMEGA32U4.25 28.52,22.23 28.25,22.5 28.25,24.48 v28.18,24.55
  Bottom 0.152: RFID.8 8.46,29.61 12.25,25.82 26.91,25.82 v28.18,24.55
RFID_RES  (via drill 0.35)
  Top 0.152: ATMEGA32U4.31 28.58,17.43 28.18,17.02 v28.18,14.6
  Bottom 0.152: RFID.2 6.03,14.37 7.4,13 22,13 23.6,14.6 v28.18,14.6
SPI_MISO  (via drill 0.35)
  Top 0.152: R7.2 26.9,7.5 v25.75,8.65 | RFID.5 2.76,21.99 1.5,23.25 1.5,30.24 | 1.5,30.24 1.5,30.25 | 1.5,30.24 4.76,33.5 13.5,33.5 15,35 15,36.5 15.36,36.87 FRAM.2
  Bottom 0.152: RFID.5 1.45,20.09 1.45,11.35 3.1,9.7 5.05,9.7 7.3,11.95 21.3,11.95 24.6,8.65 v25.75,8.65
SPI_MOSI  (via drill 0.35)
  Top 0.152: RFID.6 4.98,24.53 7.21,26.77 10.2,26.77 12.13,28.7 16.13,28.7 17.75,30.32 17.75,30.5 17.75,31.5 20.57,34.33 FRAM.5 21.83,33.67 v23,32.5 | R6.2 27.49,5.06 v27.2,5.35
  Bottom 0.152: v23,32.5 33.45,32.5 33.5,32.45 | 33.5,32.45 33.5,22 29.5,18 29.5,6.5 28.35,5.35 v27.2,5.35 | 33.5,32.45 33.5,32.55 33.68,32.73 33.73,32.73 36,35 38.85,35 39.75,35.9 OLED.4
SPI_SCK  (via drill 0.35)
  Top 0.152: RFID.7 10.07,27.07 12,29 16,29 17.5,30.5 17.5,30.6 17.5,30.61 17.5,31.61 20.2,34.3 20.2,35.2 20.59,35.59 FRAM.6 23.16,35.59 23.5,35.25 23.5,34.1 v24.05,33.55 | R5.2 29.93,2.62 v28.35,4.2
  Bottom 0.152: v24.05,33.55 24.95,33.55 25.7,32.8 33.4,32.8 33.57,32.98 33.62,32.98 37.2,36.56 37.2,36.98 | v28.35,4.2 28.35,4.92 29.8,6.37 29.8,17.87 33.8,21.87 33.8,32.42 33.92,32.42 36.2,34.7 40.3,34.7 40.95,35.35 40.95,38.4 40.25,39.1 37.95,39.1 37.2,38.35 37.2,36.98 | 37.2,36.98 OLED.3
USB_D+
  Top 0.152: USB.3 53.92,20.29 R2.1
USB_D-
  Top 0.152: R1.1 53.9,17.45 54.55,18.1 USB.2
USB_UCAP
  Top 0.152: ATMEGA32U4.6 44.09,19.83 C3.1

### Text on the board
Bottom: Thomas / Chevalier
tNames: Board designed by / Thomas Chevalier | GND | +5V | RESET | +3.3V | PD7 | PD1 | PD0 | PF7 | PF6 | MISO | PF5 | MOSI | GND | PD6 | +5V | +3.3V | PE6 | PF0 | PF1 | PF4 | SCK
bNames: thomasom.chevalier@gmail.com / Octobre 2017 / Dev board v2